# EAGLE schematic without_solar (EAGLE 9.4.2)
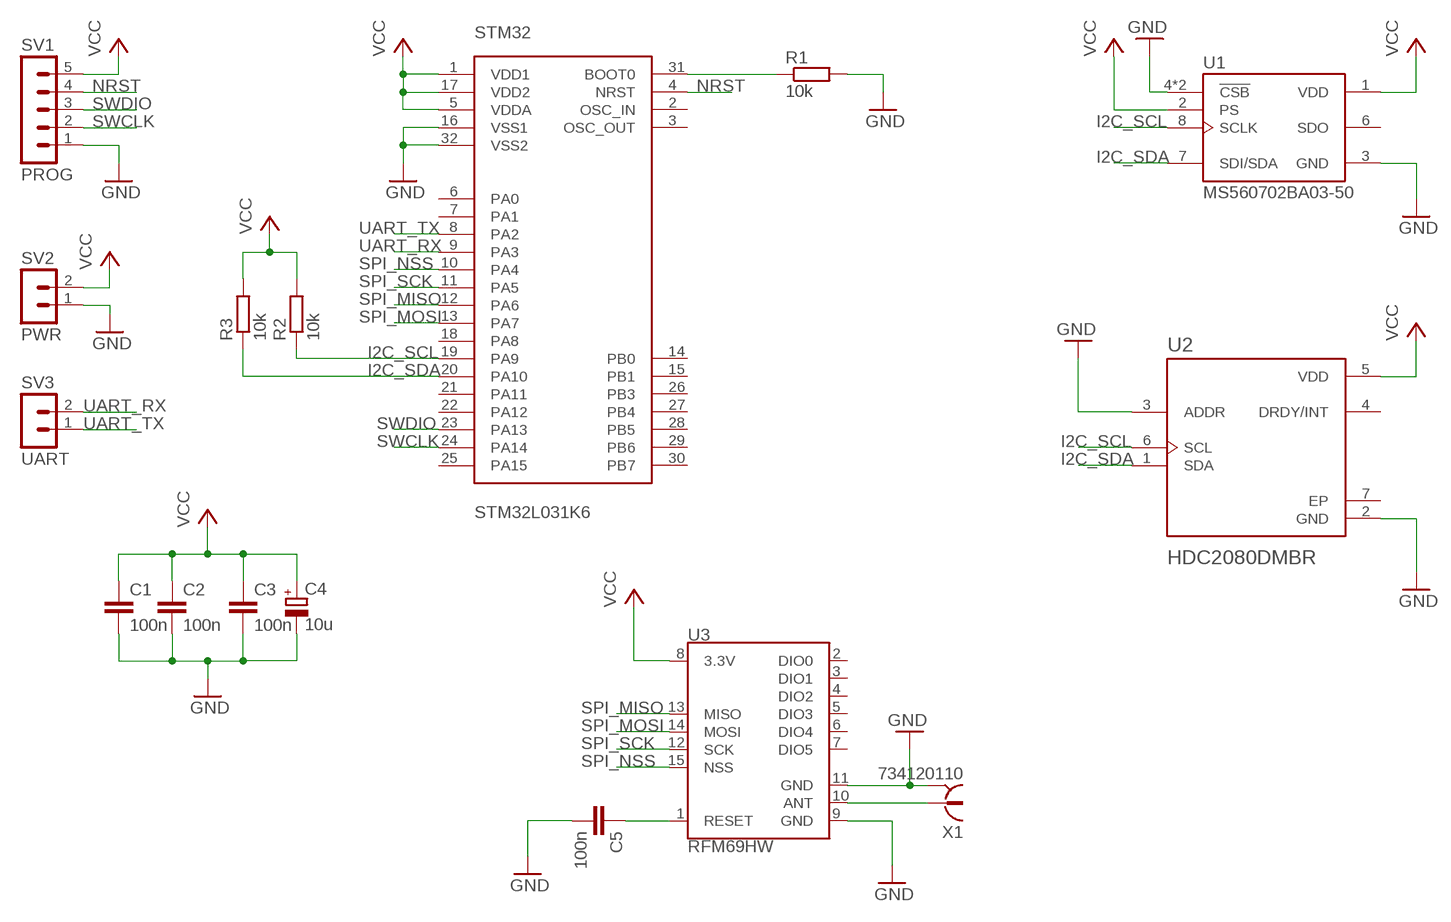
[diagram p0: schematic, sheet 1]

## Parts
C1  100n  C-EUC1206  [C1206]
C2  100n  C-EUC1206  [C1206]
C3  100n  C-EUC1206  [C1206]
C4  10u  CPOL-EUUD-4X5,8  [UD-4X5,8_NICHICON]
C5  100n  C-EUC1206  [C1206]
R1  10k  R-EU_R0805  [R0805]
R2  10k  R-EU_R0805  [R0805]
R3  10k  R-EU_R0805  [R0805]
STM32  STM32L031K6  [LQFP32-7X7]
SV1  PROG  MA05-1  [MA05-1]
SV2  PWR  MA02-1  [MA02-1]
SV3  UART  MA02-1  [MA02-1]
U1  MS560702BA03-50  [SON125P300X500X100-8N]
U2  HDC2080DMBR  [SON100P300X300X80-7N]
U3  RFM69HW  [RFM69W-XXXS2]
X1  734120110  [734120110]

## Nets
GND: C1.2 C2.2 C3.2 C4.- C5.2 R1.2 STM32.16(VSS1) STM32.32(VSS2) SV1.1 SV2.1 U1.3(GND) U1.4(!CSB) U1.5(!CSB) U2.2(GND) U2.3(ADDR) U3.9(GND) U3.11(GND) X1.S@1 X1.S@2 X1.S@3
I2C_SCL: R2.1 STM32.19(PA9) U1.8(SCLK) U2.6(SCL)
I2C_SDA: R3.1 STM32.20(PA10) U1.7(SDI/SDA) U2.1(SDA)
N$1: R1.1 STM32.31(BOOT0)
N$2: U3.10(ANT) X1.1
N$10: C5.1 U3.1(RESET)
NRST: STM32.4(NRST) SV1.4
SPI_MISO: STM32.12(PA6) U3.13(MISO)
SPI_MOSI: STM32.13(PA7) U3.14(MOSI)
SPI_NSS: STM32.10(PA4) U3.15(NSS)
SPI_SCK: STM32.11(PA5) U3.12(SCK)
SWCLK: STM32.24(PA14) SV1.2
SWDIO: STM32.23(PA13) SV1.3
UART_RX: STM32.9(PA3) SV3.2
UART_TX: STM32.8(PA2) SV3.1
VCC: C1.1 C2.1 C3.1 C4.+ R2.2 R3.2 STM32.1(VDD1) STM32.5(VDDA) STM32.17(VDD2) SV1.5 SV2.2 U1.1(VDD) U1.2(PS) U2.5(VDD) U3.8(3.3V)
Unconnected: STM32.2(OSC_IN) STM32.3(OSC_OUT) STM32.6(PA0) STM32.7(PA1) STM32.14(PB0) STM32.15(PB1) STM32.18(PA8) STM32.21(PA11) STM32.22(PA12) STM32.25(PA15) STM32.26(PB3) STM32.27(PB4) STM32.28(PB5) STM32.29(PB6) STM32.30(PB7) U1.6(SDO) U2.4(DRDY/INT) U2.7(EP) U3.2(DIO0) U3.3(DIO1) U3.4(DIO2) U3.5(DIO3) U3.6(DIO4) U3.7(DIO5)

## Library data of the parts
C1-C3 C5 = rcl:C-EU: CAPACITOR, European symbol; SPICEPREFIX: C
C4 = rcl:CPOL-EU: POLARIZED CAPACITOR, European symbol; SPICEPREFIX: C
R1-R3 = rcl:R-EU_: RESISTOR, European symbol; SPICEPREFIX: R
STM32 = dp:STM32L031K6
SV1 = con-lstb:MA05-1: PIN HEADER; OC_FARNELL: unknown; OC_NEWARK: unknown
SV2 SV3 = dp:MA02-1
U1 = MS560702BA03-50:MS560702BA03-50: BAROMETRIC PRESSURE SENSOR; AVAILABILITY: Unavailable; COMMENT: MS560702BA03-50; DESCRIPTION: MS5607-02BA03 Series 3 V 1 to 120 kPa Absolute Barometric Pressure Sensor; EU_ROHS_COMPLIANCE: Compliant; MF: TE Connectivity; MP: MS560702BA03-50; PACKAGE: SMD-8 TE Connectivity; PRICE: None; TE_PURCHASE_URL: https://www.te.com/usa-en/product-MS560702BA03-50.html?te_bu=Cor&te_type=disp&te_campaign=seda_glo_cor-seda-global-disp-prtnr-fy19-seda-model-bom-cta_sma-317_1&elqCampaignId=32493
U2 = HDC2080DMBR2:HDC2080DMBR: Low Power Humidity and Temperature Digital Sensor 6-WSON -40 to 85; AVAILABILITY: Unavailable; DESCRIPTION: Board Mount Humidity Sensors Low Power Humidity and Temperature Digital Sensor 6-WSON -40 to 85.; MF: Texas Instruments; MP: HDC2080DMBR; PACKAGE: WDFN-6 Texas Instruments; PRICE: None
U3 = SparkFun-RF:RFM69H: Hope RF RFM69H ISM Transceiver Module The RFM69H is a transceiver module capable of operation over a wide frequency range, including the 315,433,868 and 915MHz license-free ISM (Industry Scientific and Medical) frequency bands. All major RF communication parameters are programmable and most of them can be dynamically set. The RFM69H offers the unique advantage of programmable narrow-band and wide- band communication modes. The RFM69H is optimized for low power consumption while offering high RF output power and channelized operation.Compliance ETSI and FCC regulations. Datasheet <http://www.hoperf.cn/upload/docs/RF/SX/RFM69H_DataSheet_v1.3.pdf> SparkFun Products RFM69HCW Wireless Transceiver - 915MHz <https://www.sparkfun.com/products/13909> (COM-13909) RFM69HCW Wireless Transceiver - 434MHz <https://www.sparkfun.com/products/13910> (COM-13910) SparkFun RFM69 Breakout (915MHz) <https://www.sparkfun.com/products/12775> (WRL-12775) SparkFun RFM69 Breakout (434MHz) <https://www.sparkfun.com/products/12823> (WRL-12823)
X1 = con-coax:734120110: MICRO COAXIAL CONNECTOR RECEPTACLE VERTICAL Source: Data sheet <http://www.molex.com/pdm_docs/sd/734120110_sd.pdf>